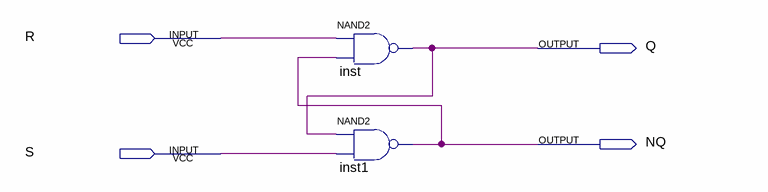
[diagram p0: schematic sheet]
// Quartus schematic latchRSNAND.bdf as structural Verilog: 2 symbols, 4 pins
module latchRSNAND (
  input  R,
  input  S,
  output Q,
  output NQ
);

  nand inst (Q, R, NQ);
  nand inst1 (NQ, Q, S);
endmodule
